# EAGLE design gps_daughter_board (EAGLE 6.5.0)
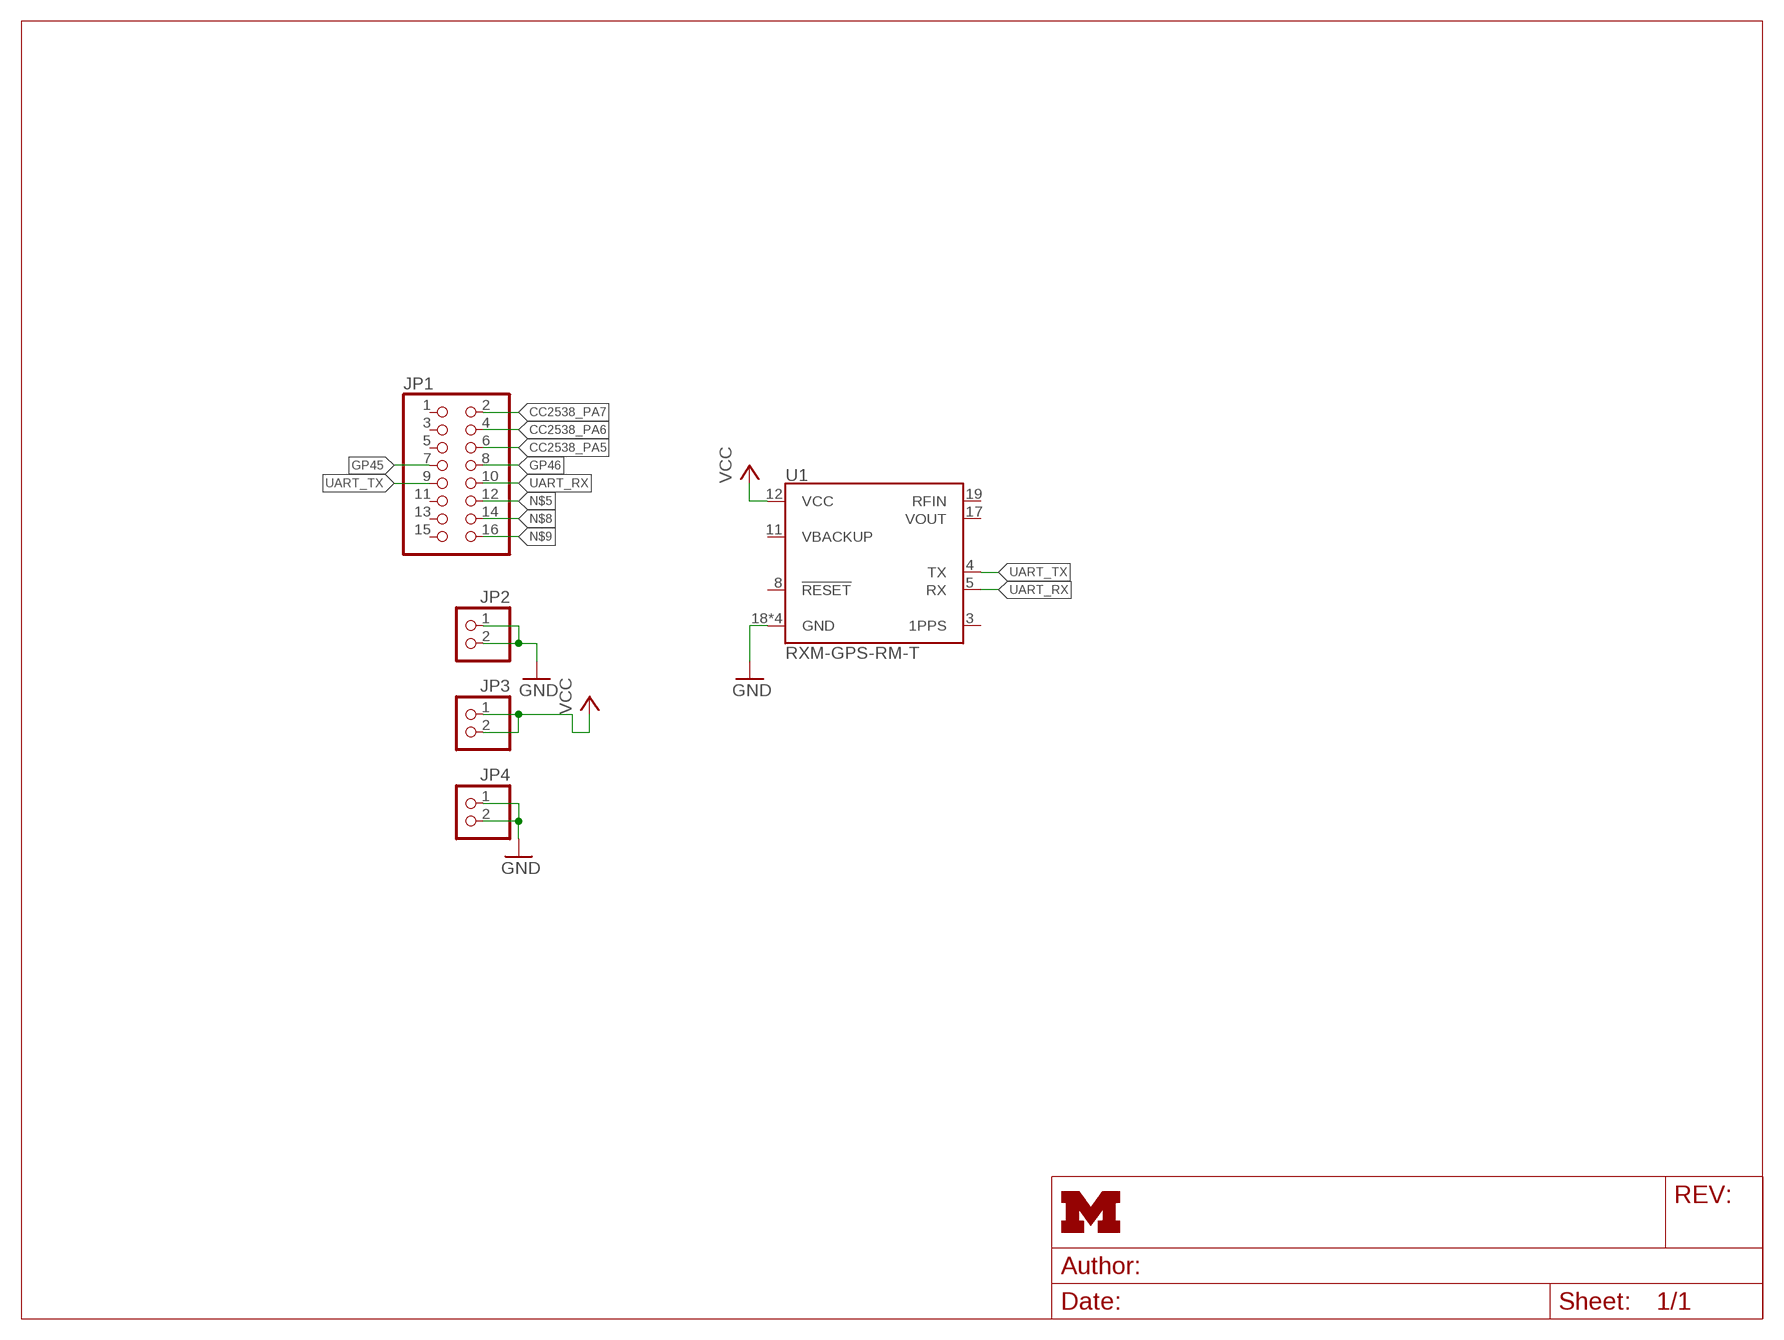
[diagram p0: schematic, sheet 1]
FRAME1 (LETTER_L): HEIGHT: 8.5in; WIDTH: 11in

## Parts
JP1  PINHD-2X8  [2X08]
JP2  PINHD-1X2  [1X02]
JP3  PINHD-1X2  [1X02]
JP4  PINHD-1X2  [1X02]
U1  RXM-GPS-RM-T  [RXM-GPS-RM-T]

## Nets
CC2538_PA5: JP1.6
CC2538_PA6: JP1.4
CC2538_PA7: JP1.2
GND: JP2.1 JP2.2 JP4.1 JP4.2 U1.18(GND) U1.20(GND) U1.21(GND) U1.22(GND)
GP45: JP1.7
GP46: JP1.8
N$5: JP1.12
N$8: JP1.14
N$9: JP1.16
UART_RX: JP1.10 U1.5(RX)
UART_TX: JP1.9 U1.4(TX)
VCC: JP3.1 JP3.2 U1.12(VCC)
Unconnected: JP1.1 JP1.3 JP1.5 JP1.11 JP1.13 JP1.15 U1.3(1PPS) U1.8(!RESET) U1.11(VBACKUP) U1.17(VOUT) U1.19(RFIN)

## Library data of the parts
JP1 = pinhead:PINHD-2X8: PIN HEADER
JP2-JP4 = pinhead:PINHD-1X2: PIN HEADER
U1 = chips:RXM-GPS-RM-T: The RM Series GPS receiver module is a self-contained high-performance Global Positioning System receiver; DIGIKEY: RXM-GPS-RM-TCT-ND

## Board
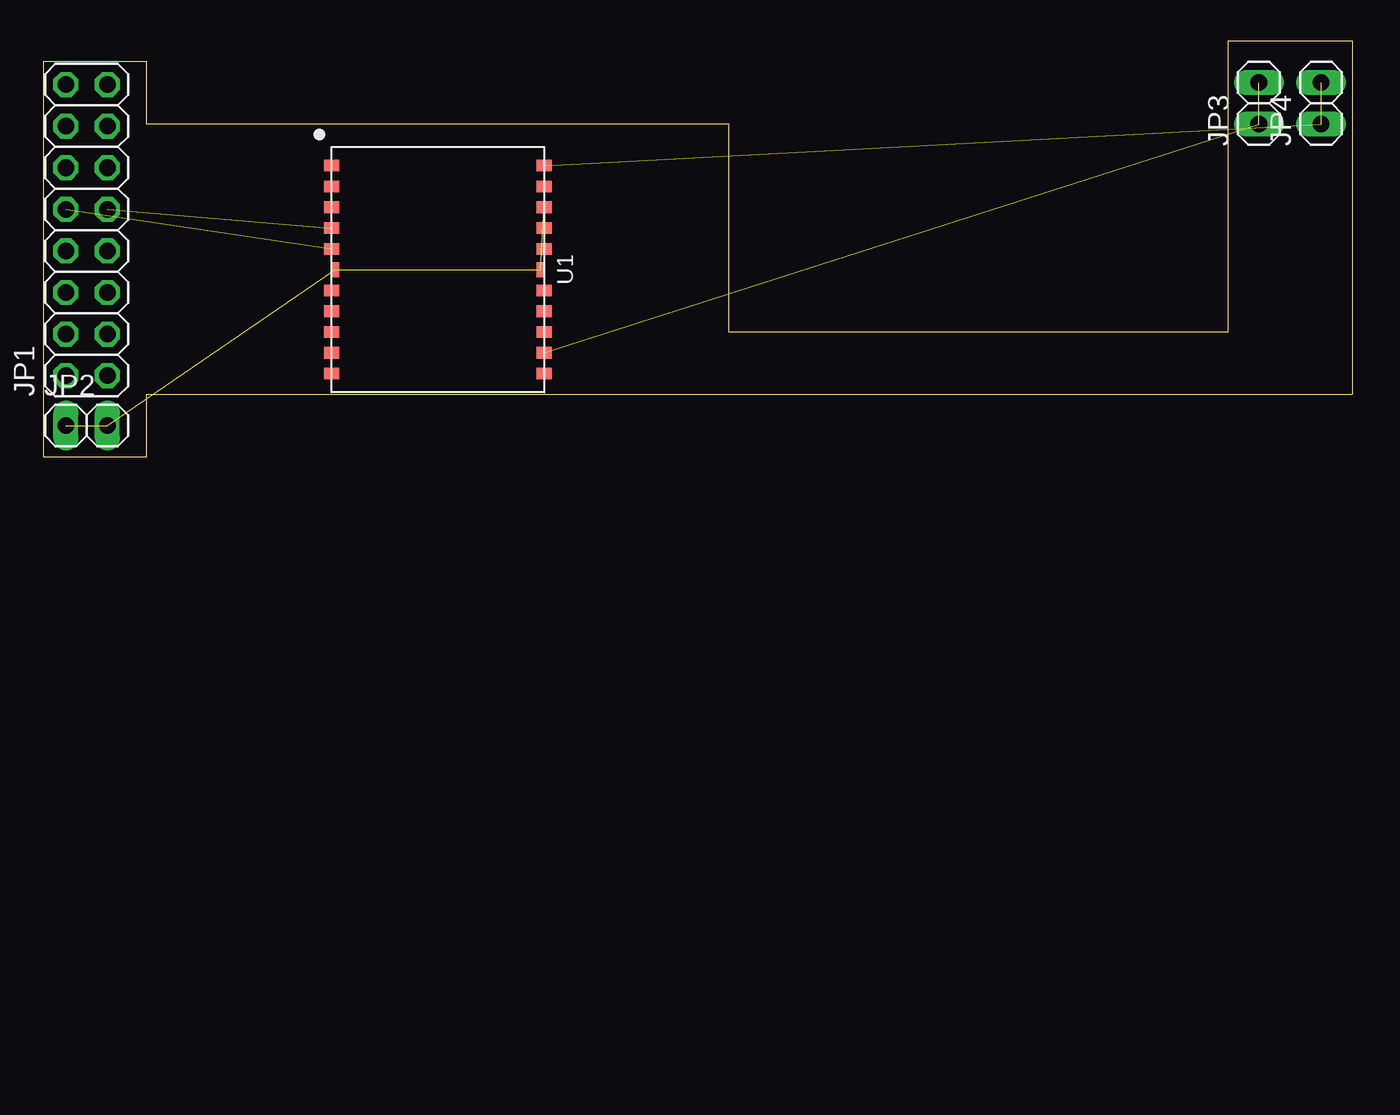
[diagram p1: board, top side]
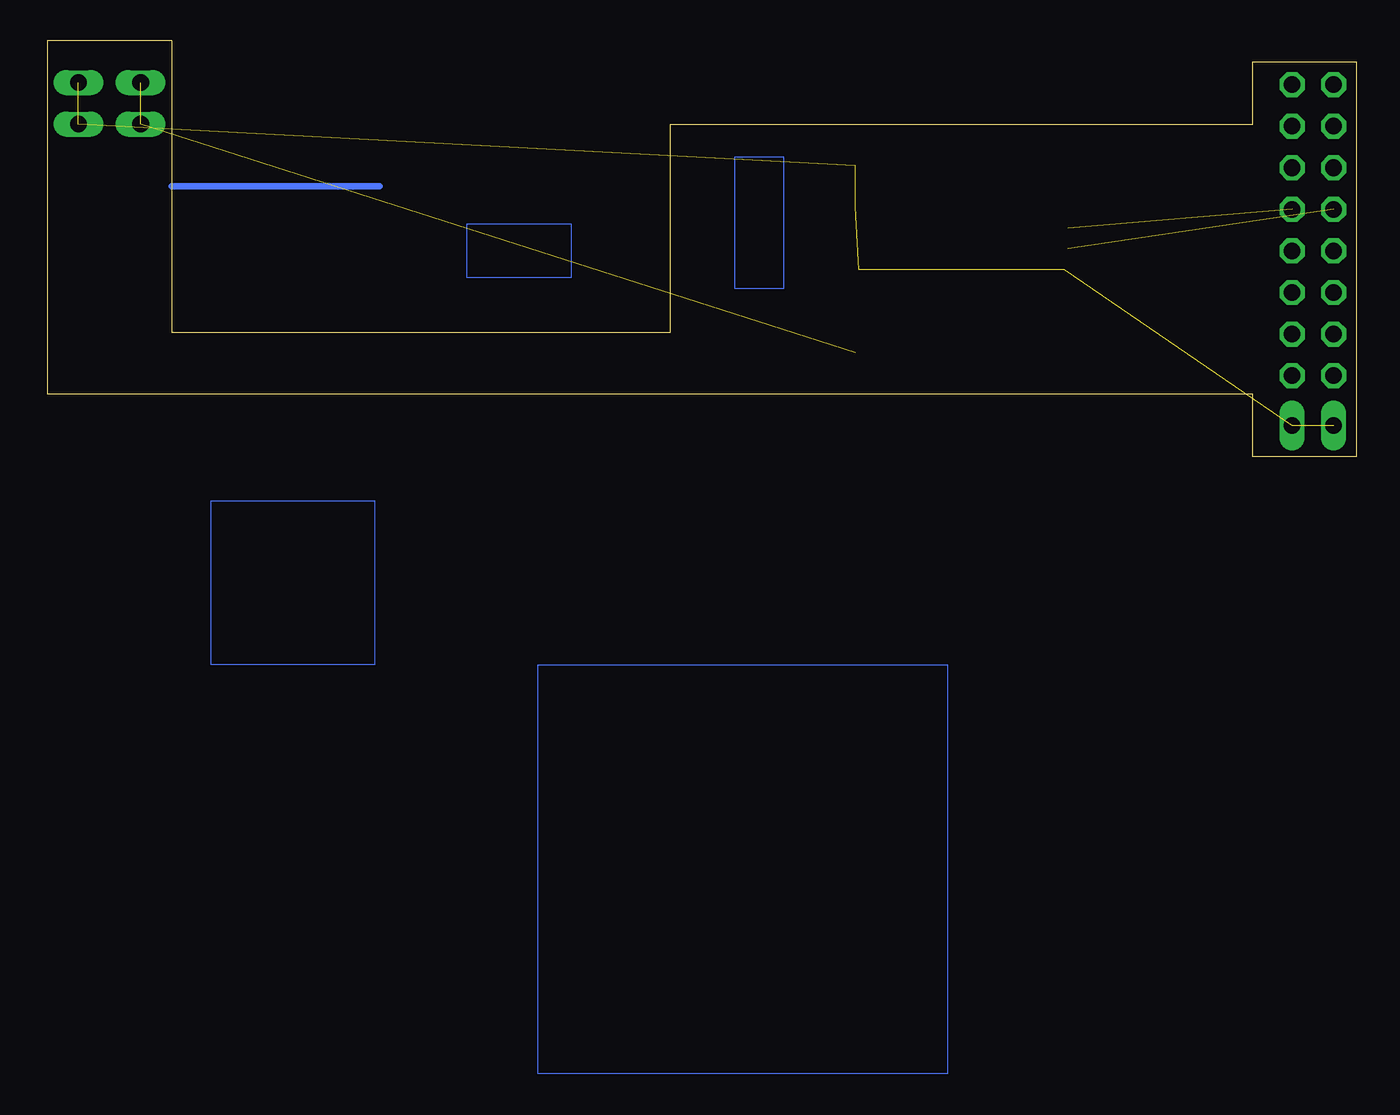
[diagram p2: board, bottom side, seen from below]

Size 80.01 x 25.4 mm. Coordinates in mm from the lower left corner, seen from the top.
Outline: 0,0 6.35,0 6.35,3.81 80.01,3.81 80.01,25.4 72.39,25.4 72.39,7.62 41.91,7.62 41.91,20.32 6.35,20.32 6.35,24.13 0,24.13 0,0
Copper layers (1*16): Top 0.035mm / dielectric 1.5mm / Bottom 0.035mm
Design rules "default": minimum track width 10mil, minimum drill 24mil, track to track 8mil, track to pad 8mil, pad to pad 8mil, via to via 8mil, smd to smd 8mil, copper to edge 40mil, drill to drill 8mil, minimum pad ring 10mil, minimum via ring 8mil, stop-mask expansion 4mil, vias tented up to drill 0mil, thermal gap 10mil

### Footprints (pad centres in the part's own frame; a part is rotated, then mirrored left to right if it is on the bottom)
2X08 = drill 1.016 octagon: 1 -8.89,-1.27; 2 -8.89,1.27; 3 -6.35,-1.27; 4 -6.35,1.27; 5 -3.81,-1.27; 6 -3.81,1.27; 7 -1.27,-1.27; 8 -1.27,1.27; 9 1.27,-1.27; 10 1.27,1.27; 11 3.81,-1.27; 12 3.81,1.27; 13 6.35,-1.27; 14 6.35,1.27; 15 8.89,-1.27; 16 8.89,1.27
1X02 = drill 1.016 long: 1 -1.27,0; 2 1.27,0
RXM-GPS-RM-T = smd 0.711 x 0.914: 1 -6.35,-6.502; 2 -5.08,-6.502; 3 -3.81,-6.502; 4 -2.54,-6.502; 5 -1.27,-6.502; 6 1.27,-6.502; 7 2.54,-6.502; 8 3.81,-6.502; 9 5.08,-6.502; 10 6.35,-6.502; 11 6.35,6.502; 12 5.08,6.502; 13 3.81,6.502; 14 2.54,6.502; 15 1.27,6.502; 16 -1.27,6.502; 17 -2.54,6.502; 18 -3.81,6.502; 19 -5.08,6.502; 20 -6.35,6.502 | smd 0.914 x 0.457: 21 0,-6.274; 22 0,6.274

### Placement (x,y rotation side)
JP1  2.67,13.84 90 top
JP2  2.67,1.91 0 top
JP3  74.3,21.59 90 top
JP4  78.11,21.59 90 top
U1  24.13,11.43 270 top

### Tracks (layer width: path | path; a pad name or v marks a point on that pad's centre or on a via)
GND  (7 unrouted)
N$1
  Bottom 0.406: 59.69,16.51 72.39,16.51
N$2
  Bottom 0: 48.01,14.22 48.01,10.92 54.36,10.92 54.36,14.22 48.01,14.22
N$3
  Bottom 0: 35,18.3 38,18.3 38,10.3 35,10.3 35,18.3
N$4
  Bottom 0: 25,-12.7 25,-37.7 50,-37.7 50,-12.7 25,-12.7
N$6
  Bottom 0: 60,-2.7 60,-12.7 70,-12.7 70,-2.7 60,-2.7
UART_RX  (1 unrouted)
UART_TX  (1 unrouted)
VCC  (2 unrouted)